# EAGLE design Cellphone_Incoming_Call_Detector (EAGLE 9.2.2)
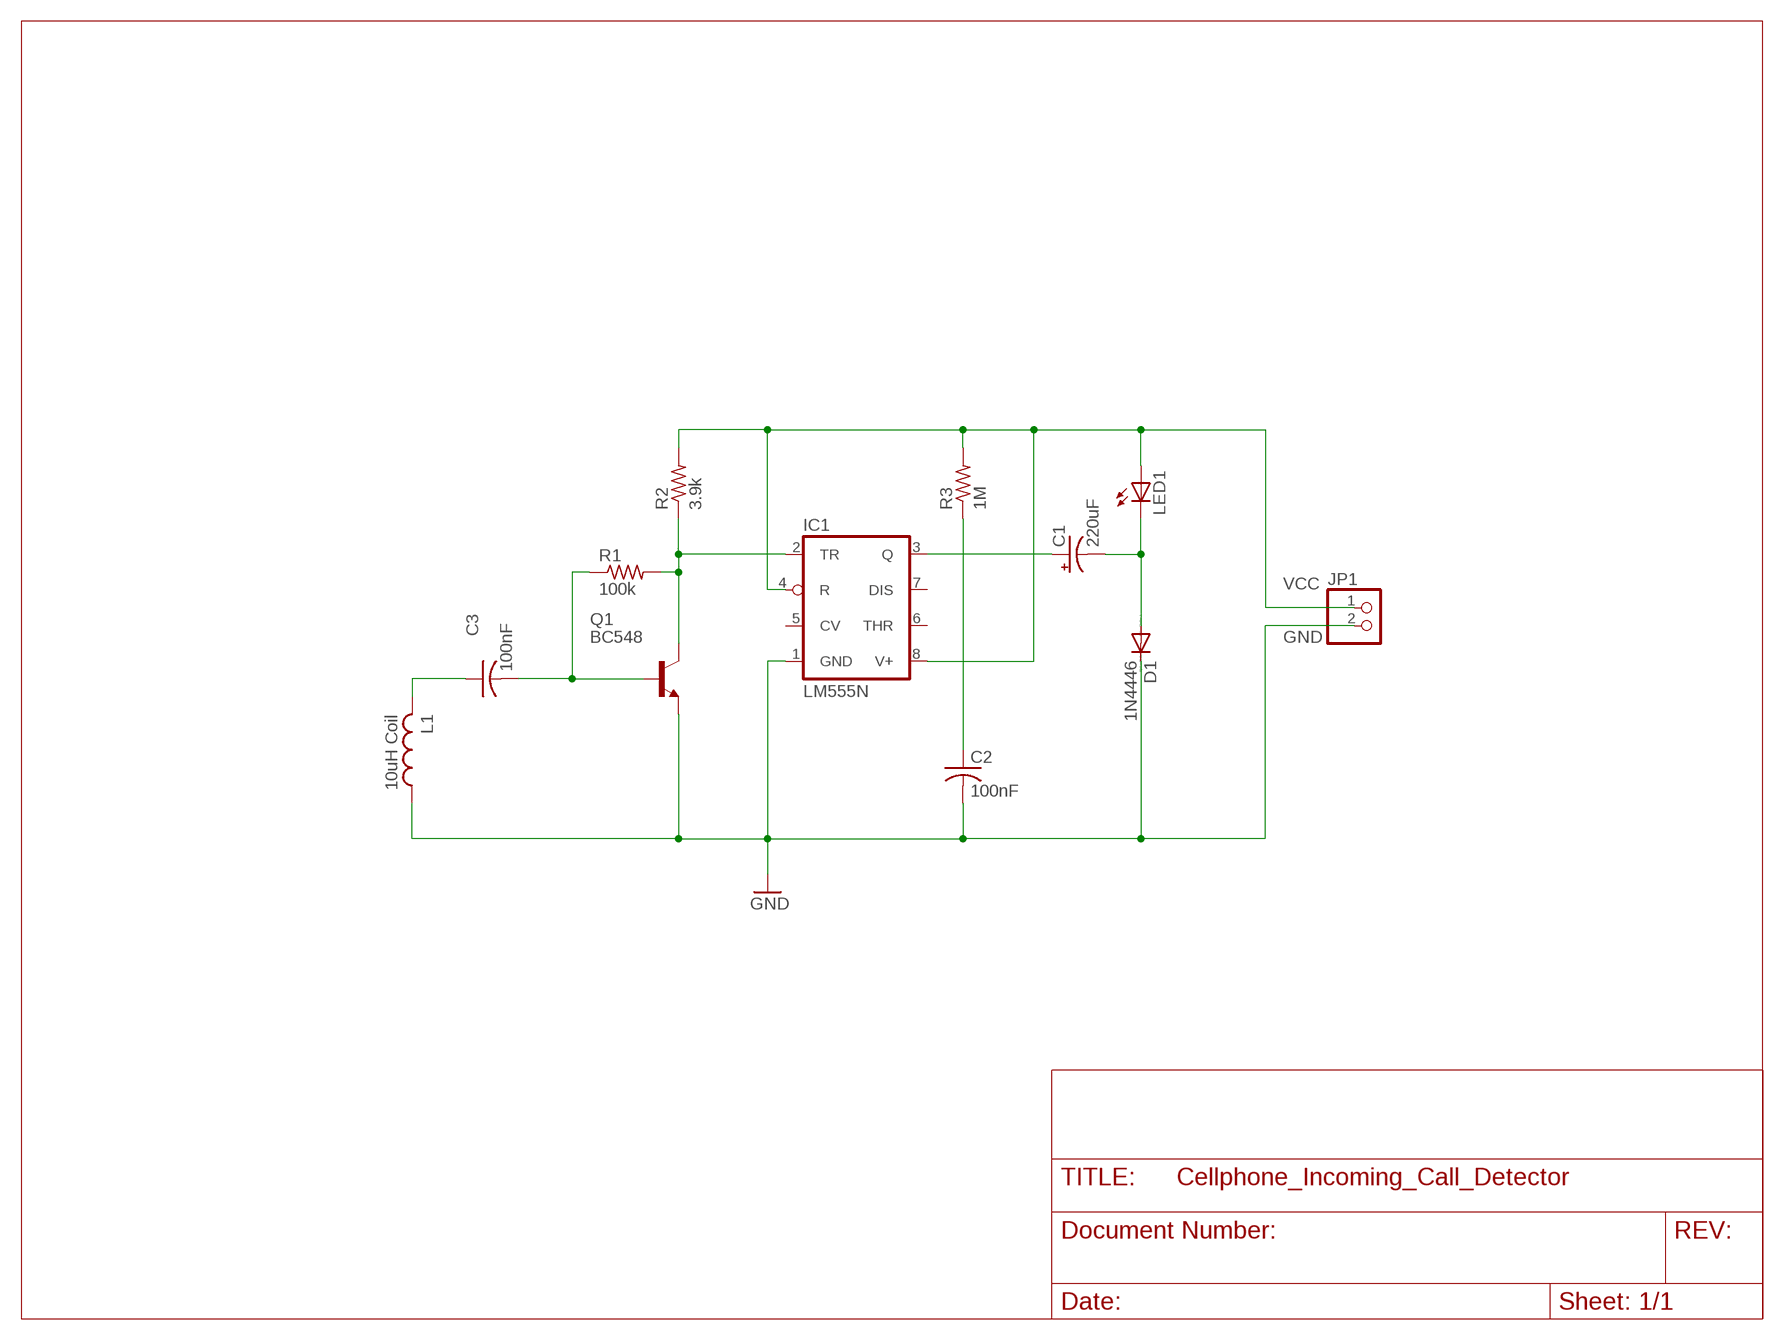
[diagram p0: schematic, sheet 1]

## Parts
C1  220uF  CPOL-USE3.5-8  [E3,5-8]
C2  100nF  C-US025-025X050  [C025-025X050]
C3  100nF  C-US025-025X050  [C025-025X050]
D1  1N4446  [DO35-10]
IC1  LM555N  [DIL08]
JP1  PINHD-1X2  [1X02]
L1  10uH Coil  L-US0204/7  [0204/7]
LED1  LED5MM  [LED5MM]
Q1  BC548  [TO92-EBC]
R1  100k  R-US_0204/7  [0204/7]
R2  3.9k  R-US_0204/7  [0204/7]
R3  1M  R-US_0204/7  [0204/7]

## Nets
GND: C2.2 D1.C IC1.1(GND) JP1.2 L1.1 Q1.E
N$1: C1.+ IC1.3(Q)
N$2: C1.- D1.A LED1.K(C)
N$3: C2.1 R3.1
N$6: C3.2 Q1.B R1.1
N$7: IC1.2(TR) Q1.C R1.2 R2.1
N$8: C3.1 L1.2
VCC: IC1.4(R) IC1.8(V+) JP1.1 LED1.A R2.2 R3.2
Unconnected: IC1.5(CV) IC1.6(THR) IC1.7(DIS)

## Library data of the parts
C1 = rcl:CPOL-US: POLARIZED CAPACITOR, American symbol; SPICEPREFIX: C
C2 C3 = rcl:C-US: CAPACITOR, American symbol; SPICEPREFIX: C
D1 = diode:1N4446: DIODE high speed (Philips)
IC1 = linear:*555: TIMER
JP1 = pinhead:PINHD-1X2: PIN HEADER
L1 = rcl:L-US: INDUCTOR, American symbol; SPICEPREFIX: L
LED1 = led:LED: LED OSRAM: - CHIPLED LG R971, LG N971, LY N971, LG Q971, LY Q971, LO R971, LY R971 LH N974, LH R974 LS Q976, LO Q976, LY Q976 LO Q996 - Hyper CHIPLED LW Q18S LB Q993, LB Q99A, LB R99A - SideLED LS A670, LO A670, LY A670, LG A670, LP A670 LB A673, LV A673, LT A673, LW A673 LH A674 LY A675 LS A676, LA A676, LO A676, LY A676, LW A676 LS A679, LY A679, LG A679 - Hyper Micro SIDELED® LS Y876, LA Y876, LO Y876, LY Y876 LT Y87S - SmartLED LW L88C, LW L88S LB L89C, LB L89S, LG L890 LS L89K, LO L89K, LY L89K LS L896, LA L896, LO L896, LY L896 - TOPLED LS T670, LO T670, LY T670, LG T670, LP T670 LSG T670, LSP T670, LSY T670, LOP T670, LYG T670 LG T671, LOG T671, LSG T671 LB T673, LV T673, LT T673, LW T673 LH T674 LS T676, LA T676, LO T676, LY T676, LB T676, LH T676, LSB T676, LW T676 LB T67C, LV T67C, LT T67C, LS T67K, LO T67K, LY T67K, LW E67C LS E67B, LA E67B, LO E67B, LY E67B, LB E67C, LV E67C, LT E67C LW T67C LS T679, LY T679, LG T679 LS T770, LO T770, LY T770, LG T770, LP T770 LB T773, LV T773, LT T773, LW T773 LH T774 LS E675, LA E675, LY E675, LS T675 LS T776, LA T776, LO T776, LY T776, LB T776 LHGB T686 LT T68C, LB T68C - Hyper Mini TOPLED® LB M676 - Mini TOPLED Santana® LG M470 LS M47K, LO M47K, LY M47K Source: http://www.osram.convergy.de LUXEON: - LUMILED® LXK2-PW12-R00, LXK2-PW12-S00, LXK2-PW14-U00, LXK2-PW14-V00 LXK2-PM12-R00, LXK2-PM12-S00, LXK2-PM14-U00 LXK2-PE12-Q00, LXK2-PE12-R00, LXK2-PE12-S00, LXK2-PE14-T00, LXK2-PE14-U00 LXK2-PB12-K00, LXK2-PB12-L00, LXK2-PB12-M00, LXK2-PB14-N00, LXK2-PB14-P00, LXK2-PB14-Q00 LXK2-PR12-L00, LXK2-PR12-M00, LXK2-PR14-Q00, LXK2-PR14-R00 LXK2-PD12-Q00, LXK2-PD12-R00, LXK2-PD12-S00 LXK2-PH12-R00, LXK2-PH12-S00 LXK2-PL12-P00, LXK2-PL12-Q00, LXK2-PL12-R00 Source: www.luxeon.com KINGBRIGHT: KA-3528ASYC Source: www.kingbright.com
Q1 = transistor-npn:BC548*: NPN Transistor
R1-R3 = rcl:R-US_: RESISTOR, American symbol; SPICEPREFIX: R

## Board
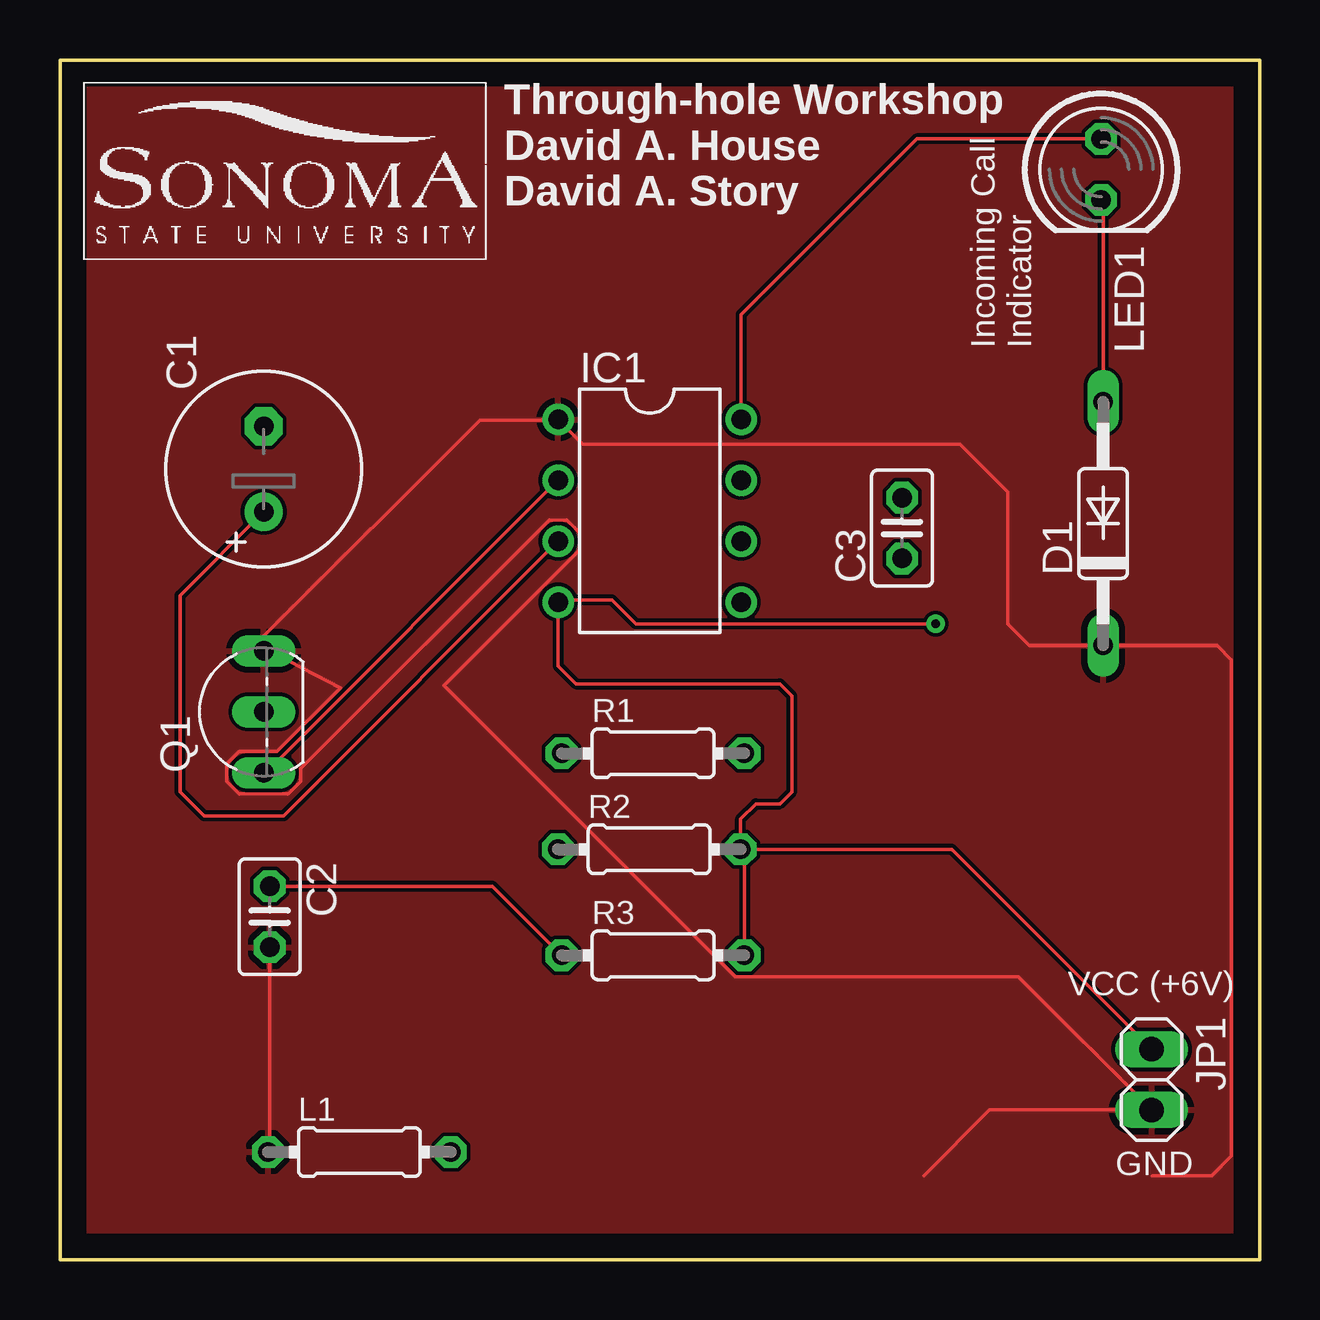
[diagram p1: board, top side]
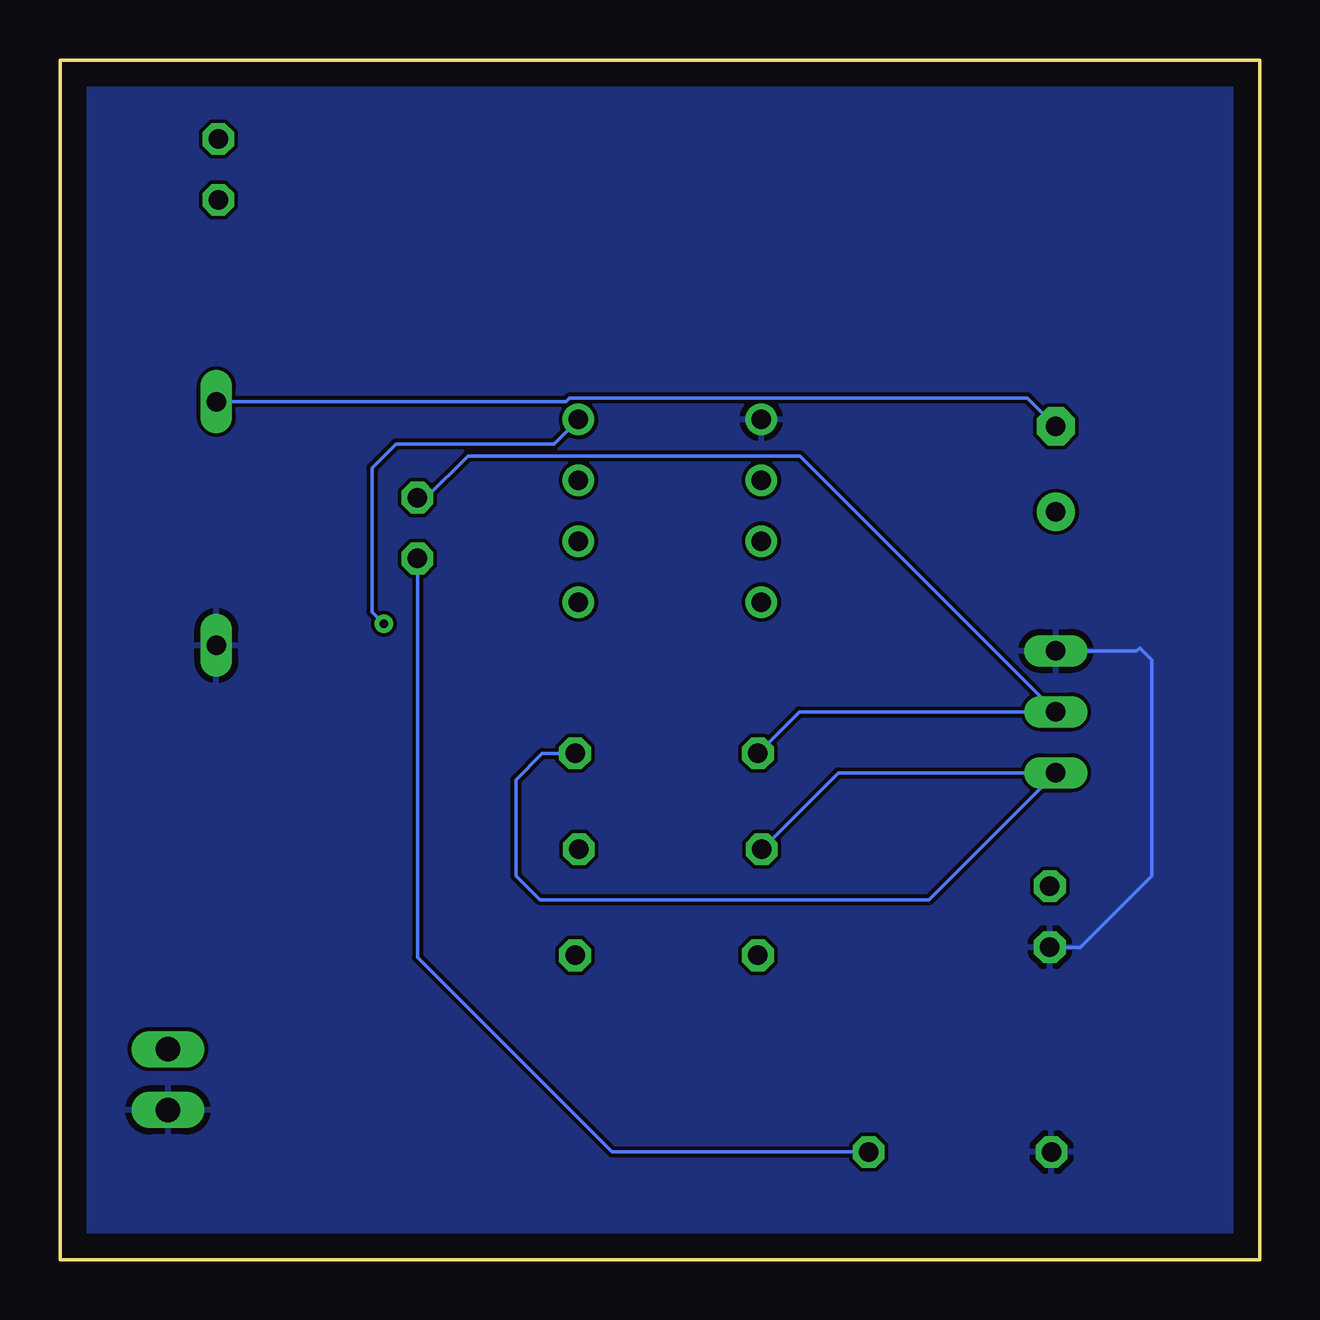
[diagram p2: board, bottom side, seen from below]

Size 50 x 50 mm. Coordinates in mm from the lower left corner, seen from the top.
Outline: 0,0 0,50 50,50 50,0 0,0
Copper layers (1*16): Top 0.035mm / dielectric 1.5mm / Bottom 0.035mm
Design rules "default": minimum track width 6mil, minimum drill 0.35mm, track to track 6mil, track to pad 6mil, pad to pad 6mil, via to via 6mil, smd to smd 6mil, copper to edge 40mil, drill to drill 6mil, minimum pad ring 10mil, minimum via ring 8mil, stop-mask expansion 4mil, vias tented up to drill 0mil, thermal gap 10mil

### Footprints (pad centres in the part's own frame; a part is rotated, then mirrored left to right if it is on the bottom)
E3,5-8 = drill 0.813 pad 1.6: + -1.778,0 | drill 0.813 pad 1.6 octagon: - 1.778,0
C025-025X050 = drill 0.813 octagon: 1 -1.27,0; 2 1.27,0
DO35-10 = drill 0.813 long: A 5.08,0; C -5.08,0
DIL08 = drill 0.813 pad 1.27: 1 -3.81,-3.81; 2 -1.27,-3.81; 3 1.27,-3.81; 4 3.81,-3.81; 5 3.81,3.81; 6 1.27,3.81; 7 -1.27,3.81; 8 -3.81,3.81
1X02 = drill 1.016 long: 1 -1.27,0; 2 1.27,0
0204/7 = drill 0.813 octagon: 1 -3.81,0; 2 3.81,0
LED5MM = drill 0.813 octagon: A -1.27,0; K 1.27,0
TO92-EBC = drill 0.813 long: B 0,-1.27; C -2.54,-1.27; E 2.54,-1.27

### Placement (x,y rotation side)
C1  8.49,32.95 90 top
C2  8.74,14.29 270 top
C3  35.1,30.49 90 top
D1  43.48,30.68 90 top
IC1  24.58,31.21 270 top
JP1  45.5,7.5 270 top
L1  12.48,4.48 0 top
LED1  43.4,45.44 270 top
Q1  7.22,22.83 90 top
R1  24.72,21.1 0 top
R2  24.56,17.1 0 top
R3  24.72,12.68 0 top

### Tracks (layer width: path | path; a pad name or v marks a point on that pad's centre or on a via)
GND
  Top 0.152: 45.53,3.5 48,3.5 48.83,4.33 48.83,25 48.23,25.6 D1.C 40.4,25.6 39.5,26.5 39.5,32 37.5,34 21.79,34 IC1.1 20.75,35 17.5,35 8.49,25.99 8.49,25.5 | 8.49,25.5 Q1.E | C2.2 8.74,4.55 L1.1 | 36,3.5 38.73,6.23 JP1.2 39.94,11.79 28.16,11.79 16.02,23.93 21.66,29.57 21.66,30.31 21.14,30.83 20.4,30.83 10.04,20.47 10.04,19.92 9.52,19.4 7.46,19.4 6.94,19.92 6.94,20.66 7.46,21.18 9.04,21.18 11.69,23.83 8.49,25.5
  Bottom 0.152: C2.2 7.52,13.02 7.5,13 4.5,16 4.5,25 5,25.5 5.13,25.37 Q1.E
  pour Top: 0,0 0,50 50,50 50,0
  pour Bottom: 0,0 0,50 50,50 50,0
N$1
  Top 0.152: IC1.3 9.33,18.5 6,18.5 5,19.5 5,27.68 C1.+
N$2
  Top 0.152: D1.A 43.48,44.09 LED1.K
  Bottom 0.152: D1.A 28.91,35.76 28.76,35.91 9.67,35.91 C1.-
N$3
  Top 0.152: R3.1 18.03,15.56 C2.1
N$6
  Bottom 0.152: C3.2 34.74,31.76 33,33.5 19.16,33.5 Q1.B 19.18,22.83 R1.1
N$7
  Top 0.152: IC1.2 8.58,20.29 Q1.C
  Bottom 0.152: R2.1 17.56,20.29 Q1.C 13.78,15 30,15 31,16 31,20 29.9,21.1 R1.2
N$8
  Bottom 0.152: C3.1 35.1,12.6 26.98,4.48 L1.2
VCC  (via drill 0.35)
  Top 0.152: R2.2 37,17.1 37.01,17.1 37.17,17.1 JP1.1 | R2.2 28.53,16.94 R3.2 | LED1.A 35.71,46.71 28.39,39.39 IC1.8 | R2.2 28.37,18.37 29,19 30,19 30.5,19.5 30.5,23.5 30,24 21.5,24 20.77,24.73 IC1.4 20.87,27.5 23,27.5 24,26.5 v36.5,26.5
  Bottom 0.152: IC1.8 29.41,34 36,34 37,33 37,27 v36.5,26.5

### Text on the board
tPlace: Through-hole Workshop / David A. House / David A. Story | Incoming Call / Indicator | VCC (+6V) | GND